# EAGLE schematic 4017-7Segment (EAGLE 7.6.0)
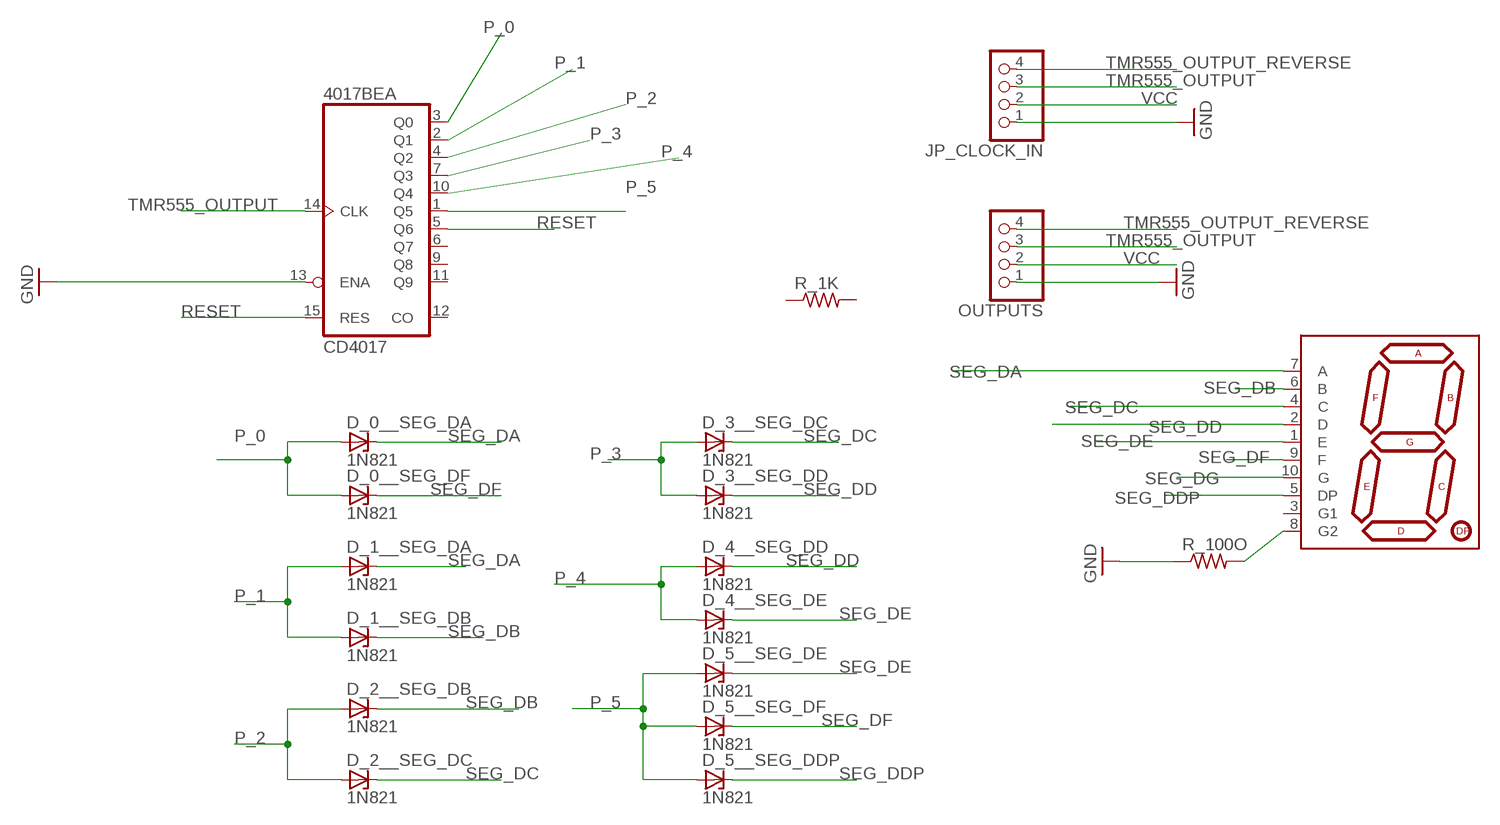
[diagram p0: schematic, sheet 1]

## Parts
4017BE  CD4017  [DIL16]
D_0__SEG_DA  1N821  [DO35Z10]
D_0__SEG_DF  1N821  [DO35Z10]
D_1__SEG_DA  1N821  [DO35Z10]
D_1__SEG_DB  1N821  [DO35Z10]
D_2__SEG_DB  1N821  [DO35Z10]
D_2__SEG_DC  1N821  [DO35Z10]
D_3__SEG_DC  1N821  [DO35Z10]
D_3__SEG_DD  1N821  [DO35Z10]
D_4__SEG_DD  1N821  [DO35Z10]
D_4__SEG_DE  1N821  [DO35Z10]
D_5__SEG_DDP  1N821  [DO35Z10]
D_5__SEG_DE  1N821  [DO35Z10]
D_5__SEG_DF  1N821  [DO35Z10]
JP_CLOCK_IN  PINHD-1X4  [1X04]
OUTPUTS  PINHD-1X4  [1X04]
R_1K  R-US_R1206  [R1206]
R_100O  R-US_R1206  [R1206]
U$1  7-SEGMENT-DISPLAYPTH  [7-SEGMENT-DISPLAY]

## Nets
GND: 4017BE.13(A:ENA) JP_CLOCK_IN.1 OUTPUTS.1 R_100O.1
N$2: R_100O.2 U$1.8(G2)
P_0: 4017BE.3(A:Q0) D_0__SEG_DA.A D_0__SEG_DF.A
P_1: 4017BE.2(A:Q1) D_1__SEG_DA.A D_1__SEG_DB.A
P_2: 4017BE.4(A:Q2) D_2__SEG_DB.A D_2__SEG_DC.A
P_3: 4017BE.7(A:Q3) D_3__SEG_DC.A D_3__SEG_DD.A
P_4: 4017BE.10(A:Q4) D_4__SEG_DD.A D_4__SEG_DE.A
P_5: 4017BE.1(A:Q5) D_5__SEG_DDP.A D_5__SEG_DE.A D_5__SEG_DF.A
RESET: 4017BE.5(A:Q6) 4017BE.15(A:RES)
SEG_DA: D_0__SEG_DA.C D_1__SEG_DA.C U$1.7(A)
SEG_DB: D_1__SEG_DB.C D_2__SEG_DB.C U$1.6(B)
SEG_DC: D_2__SEG_DC.C D_3__SEG_DC.C U$1.4(C)
SEG_DD: D_3__SEG_DD.C D_4__SEG_DD.C U$1.2(D)
SEG_DDP: D_5__SEG_DDP.C U$1.5(DP)
SEG_DE: D_4__SEG_DE.C D_5__SEG_DE.C U$1.1(E)
SEG_DF: D_0__SEG_DF.C D_5__SEG_DF.C U$1.9(F)
SEG_DG: U$1.10(G)
TMR555_OUTPUT: 4017BE.14(A:CLK) JP_CLOCK_IN.3 OUTPUTS.3
TMR555_OUTPUT_REVERSE: JP_CLOCK_IN.4 OUTPUTS.4
VCC: JP_CLOCK_IN.2 OUTPUTS.2
Unconnected: 4017BE.6(A:Q7) 4017BE.9(A:Q8) 4017BE.11(A:Q9) 4017BE.12(A:CO) R_1K.1 R_1K.2 U$1.3(G1)

## Power pins joined to a net without a drawn wire
GND: 4017BE.8(P:GND)
VCC: 4017BE.16(P:VCC)

## Library data of the parts
4017BE = SparkFun-DigitalIC:CD4017; PROD_ID: IC-11929
D_0__SEG_DA D_0__SEG_DF D_1__SEG_DA D_1__SEG_DB D_2__SEG_DB D_2__SEG_DC D_3__SEG_DC D_3__SEG_DD D_4__SEG_DD D_4__SEG_DE D_5__SEG_DDP D_5__SEG_DE D_5__SEG_DF = diode:1N821: Reference DIODE temperature compensated, 6,2 V
JP_CLOCK_IN OUTPUTS = pinhead:PINHD-1X4: PIN HEADER
R_1K R_100O = adafruit:R-US_: RESISTOR, American symbol
U$1 = SparkFun-Displays:7-SEGMENT-DISPLAY